# Altium schematic sheet Power.SchDoc
size A
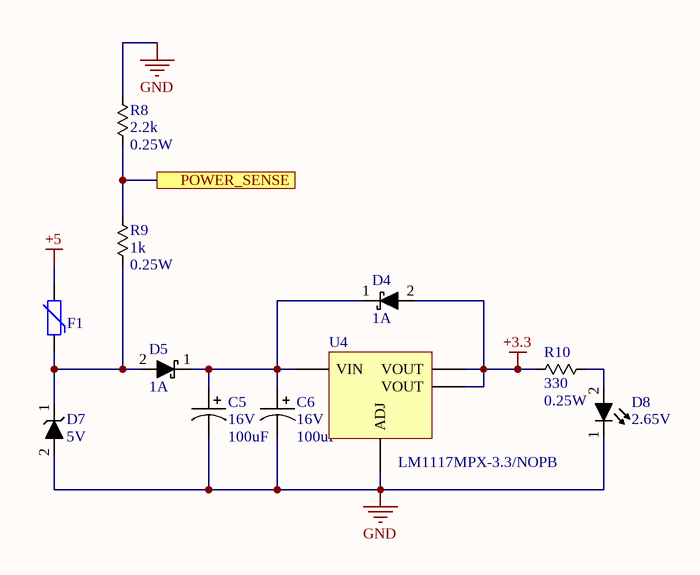
[diagram p0: Power.SchDoc]

## Parts
C5  Voltage Rating: 16V  Capacitance: 100uF  [chip_2917_AVX_TAJD]  (hidden comment: cap_single_p)
C6  Voltage Rating: 16V  Capacitance: 100uF  [chip_2917_AVX_TAJD]  (hidden comment: cap_single_p)
D4  Current Rating: 1A  [sod123_0]  (hidden comment: diode_2)
D5  Current Rating: 1A  [sod123_0]  (hidden comment: diode_2)
D7  Reverse Breakdown Voltage: 5V  [do-214ac]  (hidden comment: diode_1)
D8  Forward Voltage: 2.65V  [chip_0603]  (hidden comment: diode_4)
F1  PTC_0  [chip_1206]  (value not drawn)
R8  Resistance: 2.2k  Power Rating: 0.25W  [chip_0603]  (hidden comment: res_single)
R9  Resistance: 1k  Power Rating: 0.25W  [chip_0603]  (hidden comment: res_single)
R10  Resistance: 330  Power Rating: 0.25W  [chip_0603]  (hidden comment: res_single)
U4  Manufacturer PN: LM1117MPX-3.3/NOPB  [sot-223-4]  (hidden comment: LM1117)

## Ports
POWER_SENSE

## Nets
+3.3: D4.2 R10.1 U4.2(VOUT) U4.4(VOUT)
+5: F1.2
GND: C5.2 C6.2 D7.2 D8.1 R8.1 U4.1(ADJ)
POWER_SENSE: R8.2 R9.1 ; port POWER_SENSE
NetC5_1: C5.1 C6.1 D4.1 D5.1 U4.3(VIN)
NetD5_2: D5.2 D7.1 F1.1 R9.2
NetD8_2: D8.2 R10.2

## Library data of the parts
C5 C6 = CAP-00550: CAP, 100uF, ±10%, 16V, Tantalum, 2917; Manufacturer: AVX; Manufacturer PN: TAJD107K016RNJ; Tolerance: ±10%; Part Number: CAP-00550; Type: Tantalum; Cost: $0.94
D4 D5 = DIO-00001: Dio Shtky, 1A, 0.55V, 40V, SOD-123; Manufacturer: ON Semi; Manufacturer PN: MBR140SFT1G; Forward Voltage: 550mV; Type: Schottky; Reverse Breakdown Voltage: 40V; Part Number: DIO-00001
D7 = DIO-00036: TVS, 5V, 400W, Unidirectional; Manufacturer: ST; Manufacturer PN: SMAJ5.0A-TR; Type: TVS; Part Number: DIO-00036; Power Rating: 400W; Cost: 0.48
D8 = DIO-00050: LED, Green, 0603, Low current, HELI2 Series; Manufacturer: Kingbright; Manufacturer PN: APT1608LZGCK; Reverse Breakdown Voltage: 5V; Current Rating: 30mA; Power Rating: 120mW; Type: LED; Part Number: DIO-00050; Cost: 0.58
F1 = MISC-00008: PTC Resettable fuse, 6V, 500mA, 1206; Manufacturer: Eaton; Manufacturer PN: PTS12066V050; TEMP_CO: *; Part Number: MISC-00008; Cost: 0.3
R8 = RES-00365: RES SMD 2.2K OHM 1% 1/4W 0603; Manufacturer: Panasonic; Manufacturer PN: ERJ-PA3F2201V; Tolerance: 1%; Part Number: RES-00365
R9 = RES-00360: RES SMD 1K OHM 1% 1/4W 0603; Manufacturer: Panasonic; Manufacturer PN: ERJ-PA3F1001V; Tolerance: 1%; Part Number: RES-00360
R10 = RES-00221: RES SMD 330 OHM 1% 1/4W 0603; Manufacturer: Panasonic; Manufacturer PN: ERJ-PA3F3300V; Tolerance: 1%; Part Number: RES-00221
U4 = PWREG-00018: REG, Linear, Fixed 3V3, 800mA, SOT-223; Manufacturer: TI; Voltage Range In: 4.5 - 15V; Voltage Range Out: 3.3V; Part Number: PWREG-00018; Max Current: 800mA; Reg Type: Linear; Fixed/Adj: Fixed; Cost: 1.14